# EAGLE design VGA Connector (EAGLE 6.6.0)
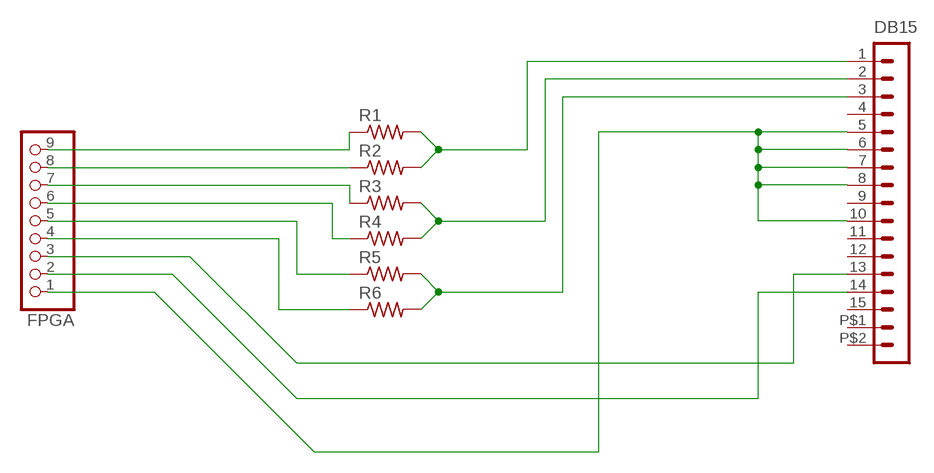
[diagram p0: schematic, sheet 1]

## Parts
DB15  CON-DSUB-15-VGA  [181-015-212-171]
FPGA  PINHD-1X9/90  [1X09/90]
R1  R-US_0207/10  [0207/10]
R2  R-US_0207/10  [0207/10]
R3  R-US_0207/10  [0207/10]
R4  R-US_0207/10  [0207/10]
R5  R-US_0207/10  [0207/10]
R6  R-US_0207/10  [0207/10]

## Nets
GND: DB15.5 DB15.6 DB15.7 DB15.8 DB15.10 FPGA.1
N$1: FPGA.9 R1.1
N$2: FPGA.8 R2.1
N$3: FPGA.7 R3.1
N$4: FPGA.6 R4.1
N$5: FPGA.5 R5.1
N$6: FPGA.4 R6.1
N$7: DB15.13 FPGA.3
N$8: DB15.14 FPGA.2
N$10: DB15.1 R1.2 R2.2
N$11: DB15.2 R3.2 R4.2
N$12: DB15.3 R5.2 R6.2
Unconnected: DB15.4 DB15.9 DB15.11 DB15.12 DB15.15 DB15.P$1 DB15.P$2

## Library data of the parts
DB15 = m-pad-2.1:CON-DSUB-15-VGA: NORCOMP's High Density 90° PC Mount D-Sub Connector 181 Series: SPECIFICATIONS: Contact Rating: 5 Amps Dielectric Strength: 1000V AC RMS Insulation Resistance: 1000 meg ohms Contact Material: Phosphor Bronze Contact Finish: Gold flash over Nickel Operating Temperature: -55°C to 150°C Shell Material: Steel, Tin Plated Insulations Material: Glass-Filled Polyester (UL94V-0) Gender: Receptacle (female) Please send any comments to: messi@users.sourceforge.net
FPGA = pinhead:PINHD-1X9: PIN HEADER
R1-R6 = rcl:R-US_: RESISTOR, American symbol

## Board
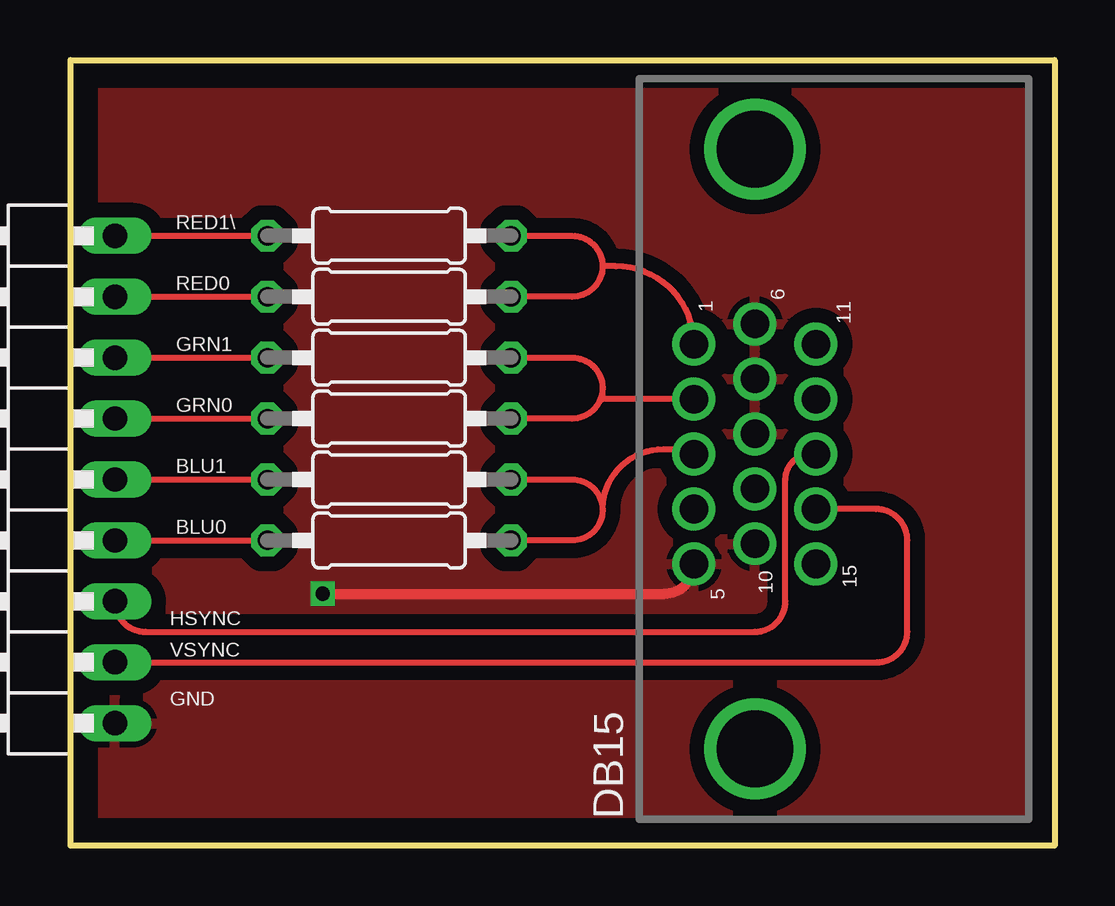
[diagram p1: board, top side]
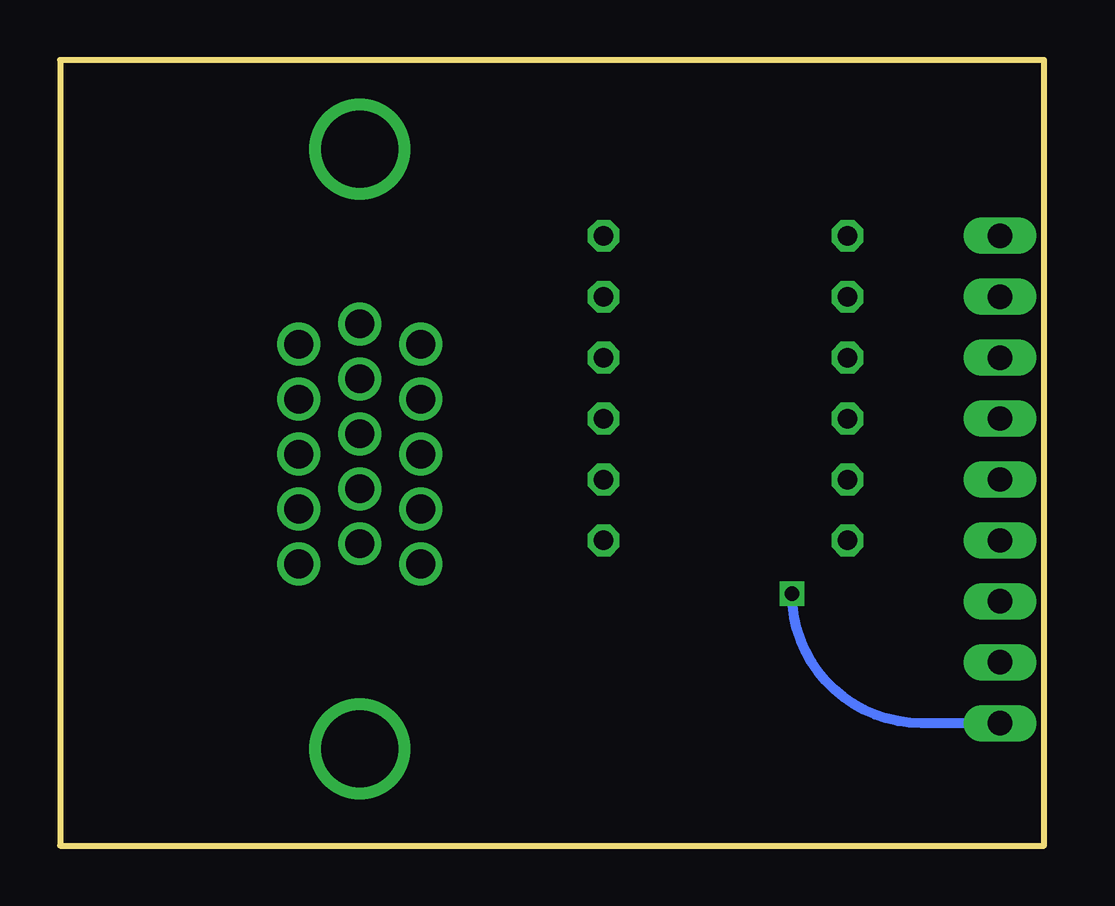
[diagram p2: board, bottom side, seen from below]

Size 41 x 32.75 mm. Coordinates in mm from the lower left corner, seen from the top.
Outline: 0,0 0,32.75 41,32.75 41,0 0,0
Copper layers (1*16): Top 0.035mm / dielectric 1.5mm / Bottom 0.035mm
Design rules "default": minimum track width 10mil, minimum drill 24mil, track to track 8mil, track to pad 8mil, pad to pad 8mil, via to via 8mil, smd to smd 8mil, copper to edge 40mil, drill to drill 8mil, minimum pad ring 10mil, minimum via ring 8mil, stop-mask expansion 4mil, vias tented up to drill 0mil, thermal gap 10mil

### Footprints (pad centres in the part's own frame; a part is rotated, then mirrored left to right if it is on the bottom)
181-015-212-171 = drill 1.194: 1 4.371,2.541; 2 2.08,2.541; 3 -0.211,2.541; 4 -2.502,2.541; 5 -4.793,2.541; 6 5.217,0; 7 2.926,0; 8 0.635,0; 9 -1.656,0; 10 -3.947,0; 11 4.371,-2.541; 12 2.08,-2.541; 13 -0.211,-2.541; 14 -2.502,-2.541; 15 -4.793,-2.541 | drill 3.2: P$1 -12.502,0; P$2 12.502,0
1X09/90 = drill 1.016 long: 1 -10.16,-3.81; 2 -7.62,-3.81; 3 -5.08,-3.81; 4 -2.54,-3.81; 5 0,-3.81; 6 2.54,-3.81; 7 5.08,-3.81; 8 7.62,-3.81; 9 10.16,-3.81
0207/10 = drill 0.813 octagon: 1 -5.08,0; 2 5.08,0

### Placement (x,y rotation side)
DB15  28.51,16.53 90 top
FPGA  -1.97,15.26 90 top
R1  13.27,25.42 0 top
R2  13.27,22.88 0 top
R3  13.27,20.34 0 top
R4  13.27,17.8 0 top
R5  13.27,15.26 0 top
R6  13.27,12.72 0 top

### Tracks (layer width: path | path; a pad name or v marks a point on that pad's centre or on a via)
GND  (via drill 0.6)
  Top 0.406: v10.5,10.5 24.73,10.5 arc90 DB15.5
  Bottom 0.406: FPGA.1 5.1,5.1 arc90 v10.5,10.5
  pour Top (isolate 0.61): -9.59,33.04 arc-90 -7.05,35.58 41.21,35.58 arc-90 45.02,31.77 45.02,-1.25 arc-90 43.75,-2.52 -5.78,-2.52 arc-90 -9.59,1.29
N$1
  Top 0.254: FPGA.9 R1.1
N$2
  Top 0.254: FPGA.8 R2.1
N$3
  Top 0.254: FPGA.7 R3.1
N$4
  Top 0.254: FPGA.6 R4.1
N$5
  Top 0.254: FPGA.5 R5.1
N$6
  Top 0.254: FPGA.4 R6.1
N$7
  Top 0.254: FPGA.3 arc90 3.11,8.91 28.51,8.91 arc90 29.78,10.18 29.78,15.26 arc-90 30.84,16.32 DB15.13
N$8
  Top 0.254: FPGA.2 33.59,7.64 arc90 34.86,8.91 34.86,12.72 arc90 33.55,14.03 DB15.14
N$10
  Top 0.254: R1.2 20.89,25.42 arc-90 22.16,24.15 | 22.16,24.15 arc-90 20.89,22.88 R2.2 | DB15.1 arc90 22.72,24.15 22.16,24.15
N$11
  Top 0.254: R3.2 20.89,20.34 arc-90 22.16,19.07 | 22.16,19.07 arc-90 20.89,17.8 R4.2 | DB15.2 22.16,18.61 22.16,19.07
N$12
  Top 0.254: R5.2 20.89,15.26 arc-90 22.16,13.99 | 22.16,13.99 arc-90 20.89,12.72 R6.2 | 22.16,13.99 arc-90 24.7,16.53 25.76,16.53 arc-90 DB15.3

### Text on the board
tPlace: RED1\ | RED0 | 6 | 1 | 11 | GRN1 | GRN0 | BLU1 | BLU0 | 15 | 5 | 10 | HSYNC | VSYNC | GND